# Altium project Apollo1260_Vreg.PrjPcb
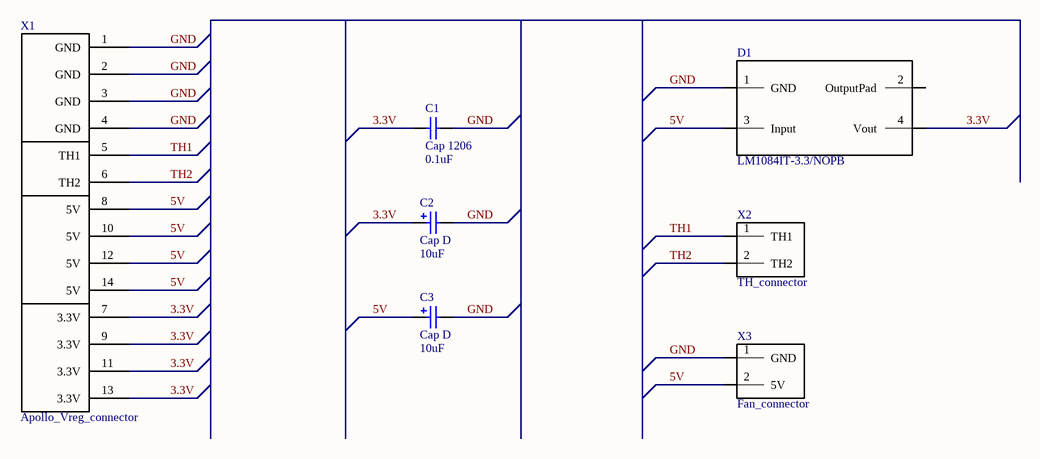
[diagram p0: Sheet1.SchDoc]
1 sheet, 7 parts. Net scope: global (net labels, ports and power ports of the same name join across sheets).
Board file: PCB1.PcbDoc

## Sheet Sheet1.SchDoc
size A4

### Parts
C1  Cap 1206  value 0.1uF  [C1206]
C2  Cap D  value 10uF  [CAPCP3825X06N]
C3  Cap D  value 10uF  [CAPCP3825X06N]
D1  LM1084IT-3.3/NOPB  [TO220HS]
X1  Apollo_Vreg_connector  [Apollo_Vreg_connector]
X2  TH_connector  [HDR1X2]
X3  Fan_connector  [HDR1X2]

### Nets
3.3V: C1.1 C2.1 D1.4(Vout) X1.7(3.3V) X1.9(3.3V) X1.11(3.3V) X1.13(3.3V)
5V: C3.1 D1.3(Input) X1.8(5V) X1.10(5V) X1.12(5V) X1.14(5V) X3.2(5V)
GND: C1.2 C2.2 C3.2 D1.1(GND) X1.1(GND) X1.2(GND) X1.3(GND) X1.4(GND) X3.1(GND)
TH1: X1.5(TH1) X2.1(TH1)
TH2: X1.6(TH2) X2.2(TH2)

Not connected (* = marked no-connect by the designer): D1 2(OutputPad)

### Library data of the parts
C1 = Cap 1206: Capacitor (Semiconductor SIM Model); Published: 8-Jun-2000; LatestRevisionDate: 29-May-2009; LatestRevisionNote: IPC-7351 Footprint Added.; PackageReference: C1206; Publisher: Altium Limited; PackageDescription: Chip Capacitor
C2 C3 = Cap D: Polarized Capacitor (Surface Mount); Published: 8-Jun-2000; LatestRevisionDate: 29-May-2009; LatestRevisionNote: IPC-7351 Footprint Added.; PackageReference: C0805; Publisher: Altium Limited; PackageDescription: Chip Capacitor